# EAGLE schematic through-hole (EAGLE 6.4)
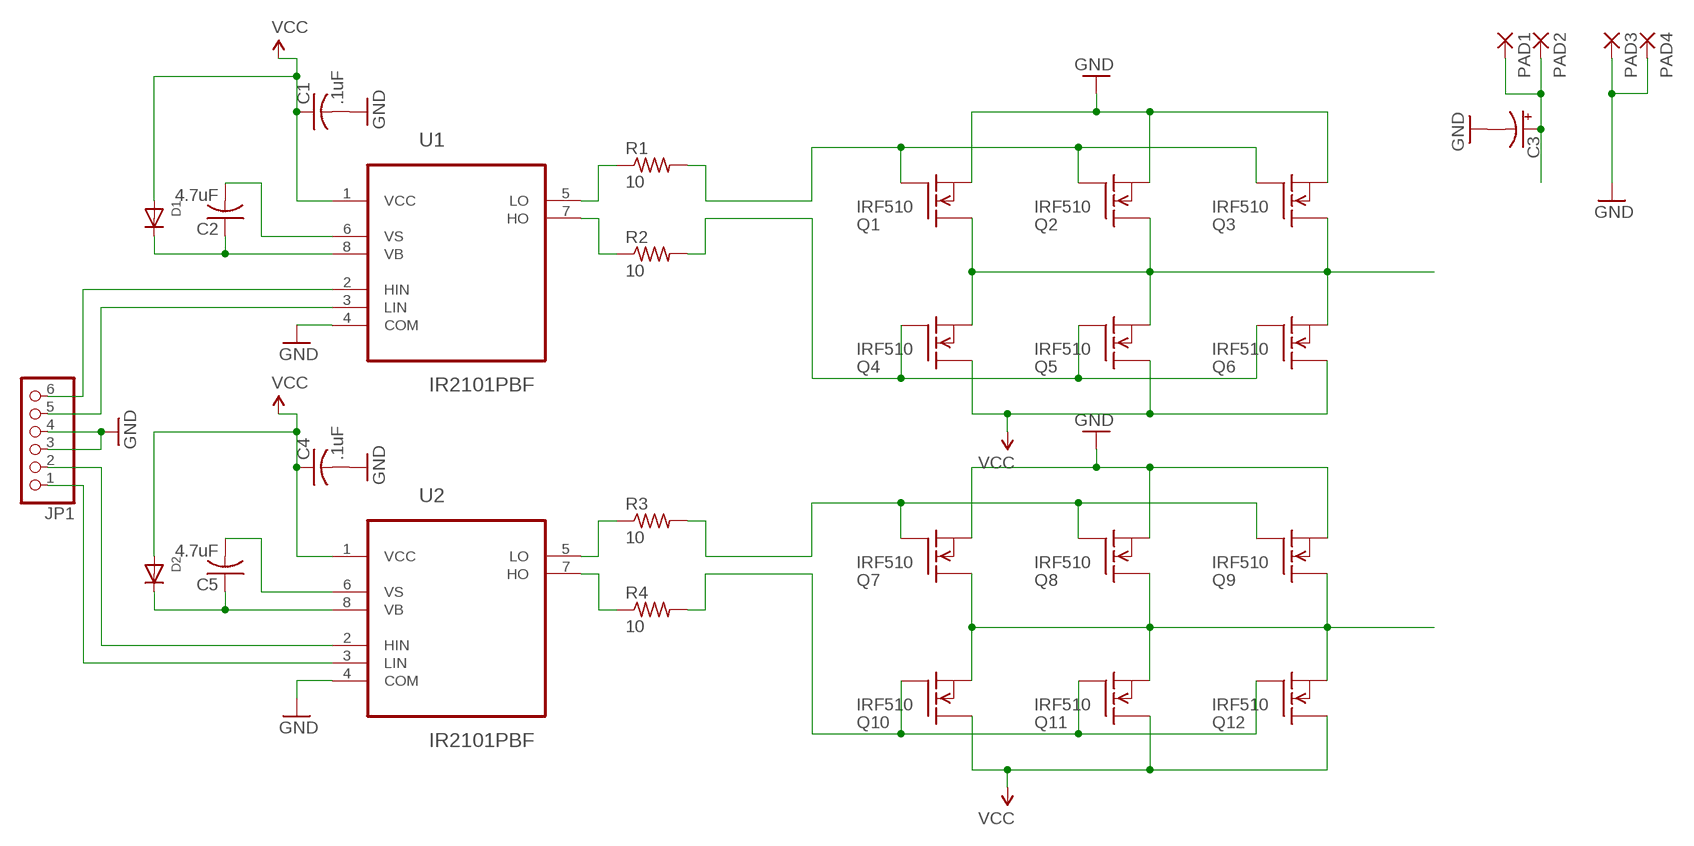
[diagram p0: schematic, sheet 1]

## Parts
C1  .1uF  C-USC0402K  [C0402K]
C2  4.7uF  C-USC0805K  [C0805K]
C3  CPOL-USE5-10.5  [E5-10,5]
C4  .1uF  C-USC0402K  [C0402K]
C5  4.7uF  C-USC0805K  [C0805K]
D1  DIODESOD-323F  [SOD-323F]
D2  DIODESOD-323F  [SOD-323F]
JP1  PINHD-1X6  [1X06]
PAD1  3,81/1,4  [3,81/1,4]
PAD2  3,81/1,4  [3,81/1,4]
PAD3  3,81/1,4  [3,81/1,4]
PAD4  3,81/1,4  [3,81/1,4]
Q1  IRF510  [TO220]
Q2  IRF510  [TO220]
Q3  IRF510  [TO220]
Q4  IRF510  [TO220]
Q5  IRF510  [TO220]
Q6  IRF510  [TO220]
Q7  IRF510  [TO220]
Q8  IRF510  [TO220]
Q9  IRF510  [TO220]
Q10  IRF510  [TO220]
Q11  IRF510  [TO220]
Q12  IRF510  [TO220]
R1  10  R-US_R0603  [R0603]
R2  10  R-US_R0603  [R0603]
R3  10  R-US_R0603  [R0603]
R4  10  R-US_R0603  [R0603]
U1  IR2101PBF  [DIP254P762X533-8]
U2  IR2101PBF  [DIP254P762X533-8]

## Nets
GND: C1.2 C3.- C4.2 JP1.3 JP1.4 PAD3.1(P) PAD4.1(P) Q1.3(S) Q2.3(S) Q3.3(S) Q7.3(S) Q8.3(S) Q9.3(S) U1.4(COM) U2.4(COM)
MTR_OUT_1: Q1.2(D) Q2.2(D) Q3.2(D) Q4.3(S) Q5.3(S) Q6.3(S)
MTR_OUT_2: Q7.2(D) Q8.2(D) Q9.2(D) Q10.3(S) Q11.3(S) Q12.3(S)
N$1: Q4.1(G) Q5.1(G) Q6.1(G) R2.2
N$2: Q1.1(G) Q2.1(G) Q3.1(G) R1.2
N$3: R3.1 U2.5(LO)
N$4: R4.1 U2.7(HO)
N$5: C2.1 D1.C U1.8(VB)
N$6: C5.1 D2.C
N$7: R1.1 U1.5(LO)
N$8: R2.1 U1.7(HO)
N$9: C2.2 U1.6(VS)
N$10: Q7.1(G) Q8.1(G) Q9.1(G) R3.2
N$11: C5.2
N$12: JP1.1 U2.3(LIN)
N$13: Q10.1(G) Q11.1(G) Q12.1(G) R4.2
N$14: C3.+ PAD1.1(P) PAD2.1(P)
N$15: JP1.2 U2.2(HIN)
N$16: JP1.6 U1.2(HIN)
N$17: JP1.5 U1.3(LIN)
VCC: C1.1 C4.1 D1.A D2.A Q4.2(D) Q5.2(D) Q6.2(D) Q10.2(D) Q11.2(D) Q12.2(D) U1.1(VCC)

## Power pins joined to a net without a drawn wire
VB: U2.8(VB)
VCC: U2.1(VCC)
VS: U2.6(VS)

## Library data of the parts
C1 C2 C4 C5 = rcl:C-US: CAPACITOR, American symbol
C3 = rcl:CPOL-US: POLARIZED CAPACITOR, American symbol
D1 D2 = adafruit:DIODE: Diode SMADIODE - SMA Surface Mount Package 20V 1A Schottky Diode Digikey: 641-1014-6-ND DO-1N4148 - Through Hole Small Current Diode SOD-123 20V 1 A (.5mV Vf) Schottky Diode - Digikey: MBRX120TPMSCT-ND SOD-323 10V 570mA (.38mV Vf, 3ns) Schottky Diode - Digikey: ZLLS410CT-ND SOD-523 30V 30mA Schottky Diode (RB751S-40TE61) - Digikey: RB751S-40TE61CT-ND SOT23-R/W - SOT23 Package (R = Solder Paste/Reflow Ovens, W = Hand-Soldering) BAT54Film 40V 300mA - Digikey: 497-7162-1-ND
JP1 = pinhead:PINHD-1X6: PIN HEADER
PAD1-PAD4 = wirepad2:3,81/1,4: THROUGH-HOLE PAD
Q1-Q12 = transistor-fet:IRF510: N-Channel Enhancement MOSFET (HEXFET); 100V; 5,6A; 0,54Ohm
R1-R4 = rcl:R-US_: RESISTOR, American symbol
U1 U2 = International_Rectifier_By_element14_Batch_1:IR2101PBF: HIGH AND LOW SIDE DRIVER; MPN: IR2101PBF; OC_FARNELL: 8638713; OC_NEWARK: 63J7837; PACKAGE: PDIP; SUPPLIER: INTERNATIONAL RECTIFIER